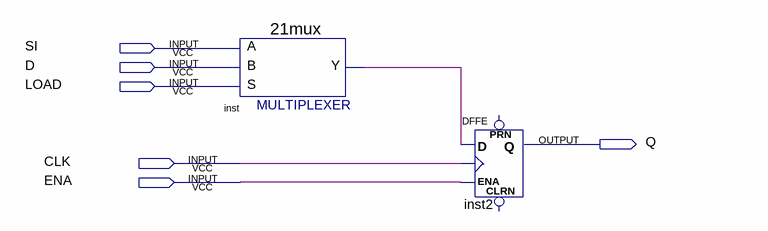
[diagram p0: schematic sheet]
// Quartus schematic lab30321SDFF.bdf as structural Verilog: 2 symbols, 6 pins
module lab30321SDFF (
  input  SI,
  input  D,
  input  LOAD,
  input  CLK,
  input  ENA,
  output Q
);

  wire inst_y;

  \21mux  inst (.S(LOAD), .B(D), .A(SI), .Y(inst_y));
  DFFE inst2 (.D(inst_y), .CLK(CLK), .ENA(ENA), .Q(Q));  // open: PRN, CLRN
endmodule
